# EAGLE design time_circuits_display (EAGLE 9.5.1)
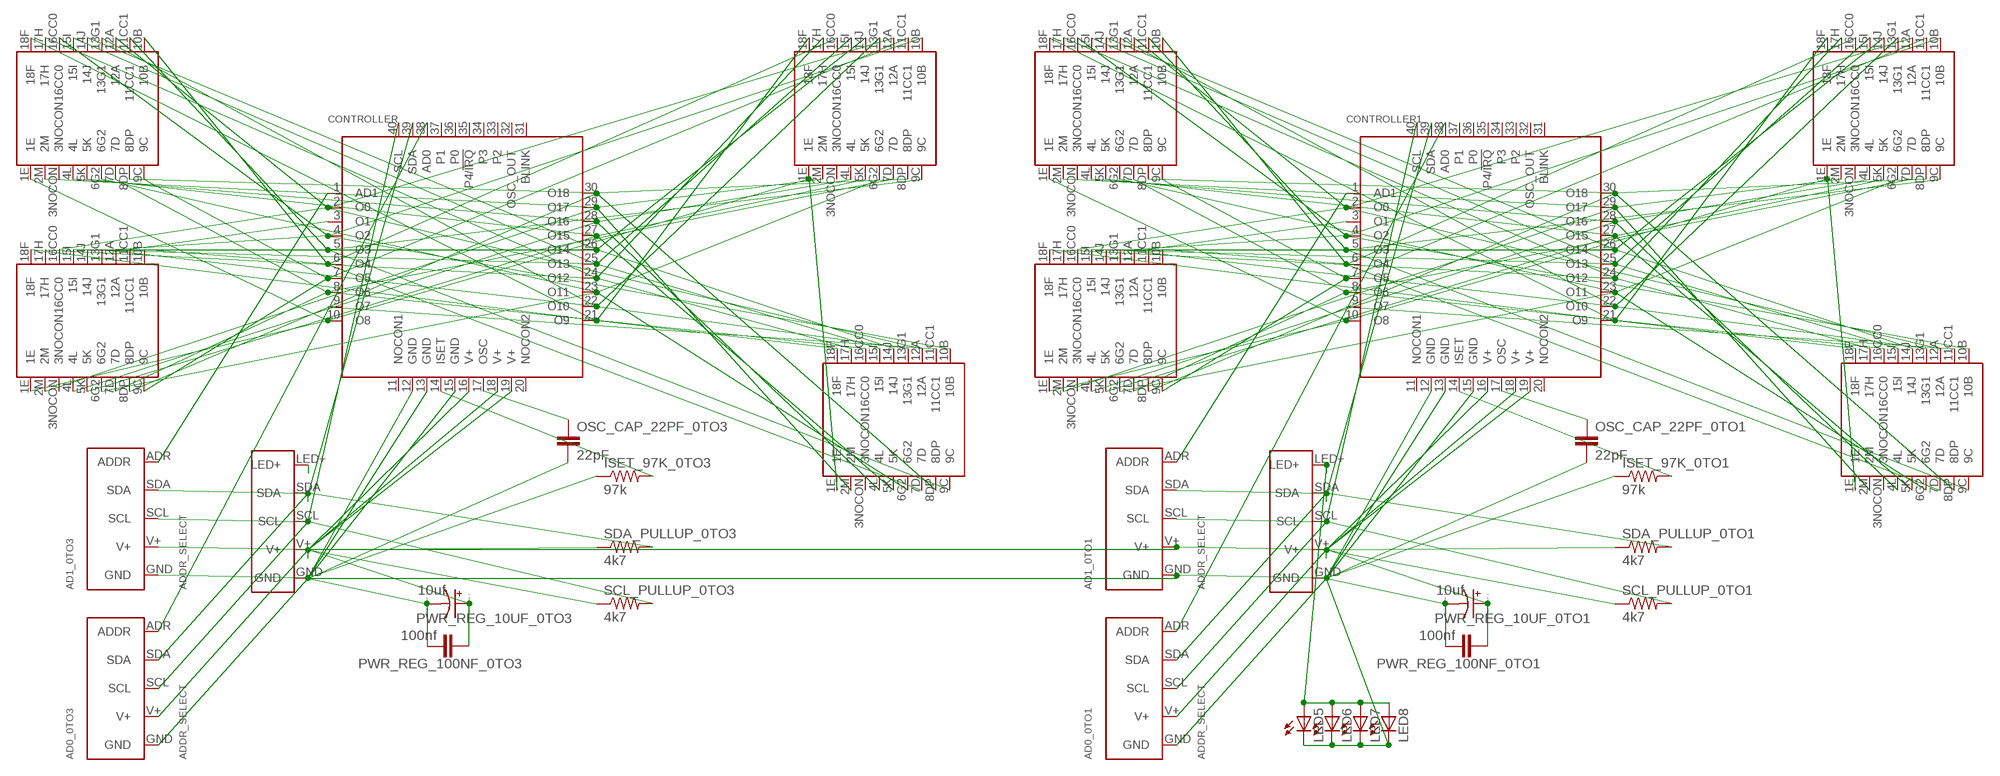
[diagram p0: schematic, sheet 1]

## Parts
AD0_0TO1  ADDR_SELECT  [ADDR_SELECT]
AD0_0TO3  ADDR_SELECT  [ADDR_SELECT]
AD1_0TO1  ADDR_SELECT  [ADDR_SELECT]
AD1_0TO3  ADDR_SELECT  [ADDR_SELECT]
CONTROLLER  MAX6955_TQFN40  [TQFN-EP-40]
CONTROLLER1  MAX6955_TQFN40  [TQFN-EP-40]
DISP0  LTP-3784  [LTP-3784]
DISP1  LTP-3784  [LTP-3784]
DISP2  LTP-3784  [LTP-3784]
DISP3  LTP-3784  [LTP-3784]
DISP4  LTP-3784  [LTP-3784]
DISP5  LTP-3784  [LTP-3784]
DISP6  LTP-3784  [LTP-3784]
DISP7  LTP-3784  [LTP-3784]
GVCD_0TO1  INTERCONNECTOR4  [INTERCONNECTOR4]
GVCD_0TO3  INTERCONNECTOR4  [INTERCONNECTOR4]
ISET_97K_0TO1  97k  R-US_0204/7  [0204/7]
ISET_97K_0TO3  97k  R-US_0204/7  [0204/7]
LED5  TLLR4400  [LED3MM]
LED6  TLLR4400  [LED3MM]
LED7  TLLR4400  [LED3MM]
LED8  TLLR4400  [LED3MM]
OSC_CAP_22PF_0TO1  22pF  C-EU025-024X044  [C025-024X044]
OSC_CAP_22PF_0TO3  22pF  C-EU025-024X044  [C025-024X044]
PWR_REG_10UF_0TO1  10uf  CPOL-USE2-5  [E2-5]
PWR_REG_10UF_0TO3  10uf  CPOL-USE2-5  [E2-5]
PWR_REG_100NF_0TO1  100nf  C-EU025-024X044  [C025-024X044]
PWR_REG_100NF_0TO3  100nf  C-EU025-024X044  [C025-024X044]
SCL_PULLUP_0TO1  4k7  R-US_0204/7  [0204/7]
SCL_PULLUP_0TO3  4k7  R-US_0204/7  [0204/7]
SDA_PULLUP_0TO1  4k7  R-US_0204/7  [0204/7]
SDA_PULLUP_0TO3  4k7  R-US_0204/7  [0204/7]

## Nets
GND: AD0_0TO1.GND AD0_0TO3.GND AD1_0TO1.GND AD1_0TO3.GND CONTROLLER1.12(GND) CONTROLLER1.13(GND) CONTROLLER1.15(GND) CONTROLLER.12(GND) CONTROLLER.13(GND) CONTROLLER.15(GND) GVCD_0TO1.GND GVCD_0TO3.GND ISET_97K_0TO1.1 ISET_97K_0TO3.1 LED5.K(C) LED6.K(C) LED7.K(C) LED8.K(C) OSC_CAP_22PF_0TO1.2 OSC_CAP_22PF_0TO3.2 PWR_REG_10UF_0TO1.- PWR_REG_10UF_0TO3.- PWR_REG_100NF_0TO1.2 PWR_REG_100NF_0TO3.2
N$1: CONTROLLER.21(O9) DISP0.18F DISP1.18F DISP2.18F DISP3.18F
N$2: AD1_0TO3.ADR(ADDR) CONTROLLER.1(AD1)
N$3: CONTROLLER.10(O8) DISP0.1E DISP1.1E DISP2.1E DISP3.1E
N$4: AD1_0TO1.ADR(ADDR) CONTROLLER1.1(AD1)
N$5: CONTROLLER.25(O13) DISP0.15I DISP1.15I DISP2.15I DISP3.15I
N$6: AD0_0TO3.ADR(ADDR) CONTROLLER.38(AD0)
N$7: CONTROLLER.2(O0) DISP0.16CC0 DISP1.12A DISP2.12A DISP3.12A
N$8: CONTROLLER.3(O1) DISP0.11CC1
N$9: CONTROLLER.4(O2) DISP0.12A DISP1.16CC0 DISP2.10B DISP3.10B
N$10: CONTROLLER.5(O3) DISP1.11CC1 DISP2.9C DISP3.9C
N$11: CONTROLLER.6(O4) DISP0.10B DISP1.10B DISP2.16CC0 DISP3.7D
N$12: CONTROLLER.7(O5) DISP0.9C DISP1.9C DISP2.11CC1
N$13: CONTROLLER.22(O10) DISP0.13G1 DISP1.13G1 DISP2.13G1 DISP3.13G1
N$14: CONTROLLER.9(O7) DISP3.11CC1
N$16: CONTROLLER.23(O11) DISP0.6G2 DISP1.6G2 DISP2.6G2 DISP3.6G2
N$17: CONTROLLER.24(O12) DISP0.17H DISP1.17H DISP2.17H DISP3.17H
N$18: CONTROLLER.26(O14) DISP0.14J DISP1.14J DISP2.14J DISP3.14J
N$19: CONTROLLER.27(O15) DISP0.5K DISP1.5K DISP2.5K DISP3.5K
N$20: CONTROLLER.28(O16) DISP0.4L DISP1.4L DISP2.4L DISP3.4L
N$21: CONTROLLER.29(O17) DISP0.2M DISP1.2M DISP2.2M DISP3.2M
N$22: CONTROLLER.30(O18) DISP0.8DP DISP1.8DP DISP2.8DP DISP3.8DP
N$23: CONTROLLER.17(OSC) OSC_CAP_22PF_0TO3.1
N$24: CONTROLLER.14(ISET) ISET_97K_0TO3.2
N$25: AD0_0TO3.SCL AD1_0TO3.SCL CONTROLLER.40(SCL) GVCD_0TO3.SCL SCL_PULLUP_0TO3.2
N$26: AD0_0TO1.ADR(ADDR) CONTROLLER1.38(AD0)
N$27: CONTROLLER.8(O6) DISP0.7D DISP1.7D DISP2.7D DISP3.16CC0
N$28: AD0_0TO3.SDA AD1_0TO3.SDA CONTROLLER.39(SDA) GVCD_0TO3.SDA SDA_PULLUP_0TO3.2
N$30: CONTROLLER1.2(O0) DISP4.16CC0 DISP5.12A DISP6.12A DISP7.12A
N$31: CONTROLLER1.3(O1) DISP4.11CC1
N$32: CONTROLLER1.4(O2) DISP4.12A DISP5.16CC0 DISP6.10B DISP7.10B
N$33: CONTROLLER1.5(O3) DISP5.11CC1 DISP6.9C DISP7.9C
N$34: CONTROLLER1.6(O4) DISP4.10B DISP5.10B DISP6.16CC0 DISP7.7D
N$35: CONTROLLER1.7(O5) DISP4.9C DISP5.9C DISP6.11CC1
N$36: CONTROLLER1.22(O10) DISP4.13G1 DISP5.13G1 DISP6.13G1 DISP7.13G1
N$37: CONTROLLER1.9(O7) DISP7.11CC1
N$38: CONTROLLER1.23(O11) DISP4.6G2 DISP5.6G2 DISP6.6G2 DISP7.6G2
N$39: CONTROLLER1.24(O12) DISP4.17H DISP5.17H DISP6.17H DISP7.17H
N$40: CONTROLLER1.26(O14) DISP4.14J DISP5.14J DISP6.14J DISP7.14J
N$41: CONTROLLER1.27(O15) DISP4.5K DISP5.5K DISP6.5K DISP7.5K
N$42: CONTROLLER1.28(O16) DISP4.4L DISP5.4L DISP6.4L DISP7.4L
N$43: CONTROLLER1.29(O17) DISP4.2M DISP5.2M DISP6.2M DISP7.2M
N$44: CONTROLLER1.30(O18) DISP4.8DP DISP5.8DP DISP6.8DP DISP7.8DP
N$45: CONTROLLER1.17(OSC) OSC_CAP_22PF_0TO1.1
N$46: CONTROLLER1.14(ISET) ISET_97K_0TO1.2
N$47: CONTROLLER1.8(O6) DISP4.7D DISP5.7D DISP6.7D DISP7.16CC0
N$48: AD0_0TO1.SDA AD1_0TO1.SDA CONTROLLER1.39(SDA) GVCD_0TO1.SDA SDA_PULLUP_0TO1.2
N$50: AD0_0TO1.SCL AD1_0TO1.SCL CONTROLLER1.40(SCL) GVCD_0TO1.SCL SCL_PULLUP_0TO1.2
N$51: GVCD_0TO1.LED+ LED5.A LED6.A LED7.A LED8.A
N$53: CONTROLLER1.21(O9) DISP4.18F DISP5.18F DISP6.18F DISP7.18F
N$54: CONTROLLER1.10(O8) DISP4.1E DISP5.1E DISP6.1E DISP7.1E
N$55: CONTROLLER1.25(O13) DISP4.15I DISP5.15I DISP6.15I DISP7.15I
N$57: GVCD_0TO3.LED+
VCC: AD0_0TO1.V+ AD0_0TO3.V+ AD1_0TO1.V+ AD1_0TO3.V+ CONTROLLER1.16(V+) CONTROLLER1.18(V+) CONTROLLER1.19(V+) CONTROLLER.16(V+) CONTROLLER.18(V+) CONTROLLER.19(V+) GVCD_0TO1.V+ GVCD_0TO3.V+ PWR_REG_10UF_0TO1.+ PWR_REG_10UF_0TO3.+ PWR_REG_100NF_0TO1.1 PWR_REG_100NF_0TO3.1 SCL_PULLUP_0TO1.1 SCL_PULLUP_0TO3.1 SDA_PULLUP_0TO1.1 SDA_PULLUP_0TO3.1
Unconnected: CONTROLLER1.11(NOCON1) CONTROLLER1.20(NOCON2) CONTROLLER1.31(BLINK) CONTROLLER1.32(OSC_OUT) CONTROLLER1.33(P2) CONTROLLER1.34(P3) CONTROLLER1.35(P4/!IRQ) CONTROLLER1.36(P0) CONTROLLER1.37(P1) CONTROLLER.11(NOCON1) CONTROLLER.20(NOCON2) CONTROLLER.31(BLINK) CONTROLLER.32(OSC_OUT) CONTROLLER.33(P2) CONTROLLER.34(P3) CONTROLLER.35(P4/!IRQ) CONTROLLER.36(P0) CONTROLLER.37(P1) DISP0.3NOCON DISP1.3NOCON DISP2.3NOCON DISP3.3NOCON DISP4.3NOCON DISP5.3NOCON DISP6.3NOCON DISP7.3NOCON

## Library data of the parts
AD0_0TO1 AD0_0TO3 AD1_0TO1 AD1_0TO3 = 00RonBarry:ADDR_SELECT
CONTROLLER CONTROLLER1 = MAX6955_TQFN40:MAX6955_TQFN40
DISP0 DISP1-DISP7 = 00RonBarry:LTP-3784
GVCD_0TO1 GVCD_0TO3 = 00RonBarry:INTERCONNECTOR4
ISET_97K_0TO1 ISET_97K_0TO3 SCL_PULLUP_0TO1 SCL_PULLUP_0TO3 SDA_PULLUP_0TO1 SDA_PULLUP_0TO3 = resistor:R-US_: RESISTOR, American symbol
LED5-LED8 = led:TLLR4400: Low Current (2mA) LED 3 mm Tinted Diffused Package color RED Source: Data sheet <http://www.farnell.com/datasheets/391100.pdf>; MF: VISHAY SEMICONDUCTOR; OC_FARNELL: 1612437
OSC_CAP_22PF_0TO1 OSC_CAP_22PF_0TO3 = resistor:C-EU: CAPACITOR, European symbol
PWR_REG_10UF_0TO1 PWR_REG_10UF_0TO3 = resistor:CPOL-US: POLARIZED CAPACITOR, American symbol
PWR_REG_100NF_0TO1 PWR_REG_100NF_0TO3 = rcl:C-EU: CAPACITOR, European symbol; SPICEPREFIX: C

## Net classes
0 default: width 0.254 mm, clearance 0.229 mm

## Board
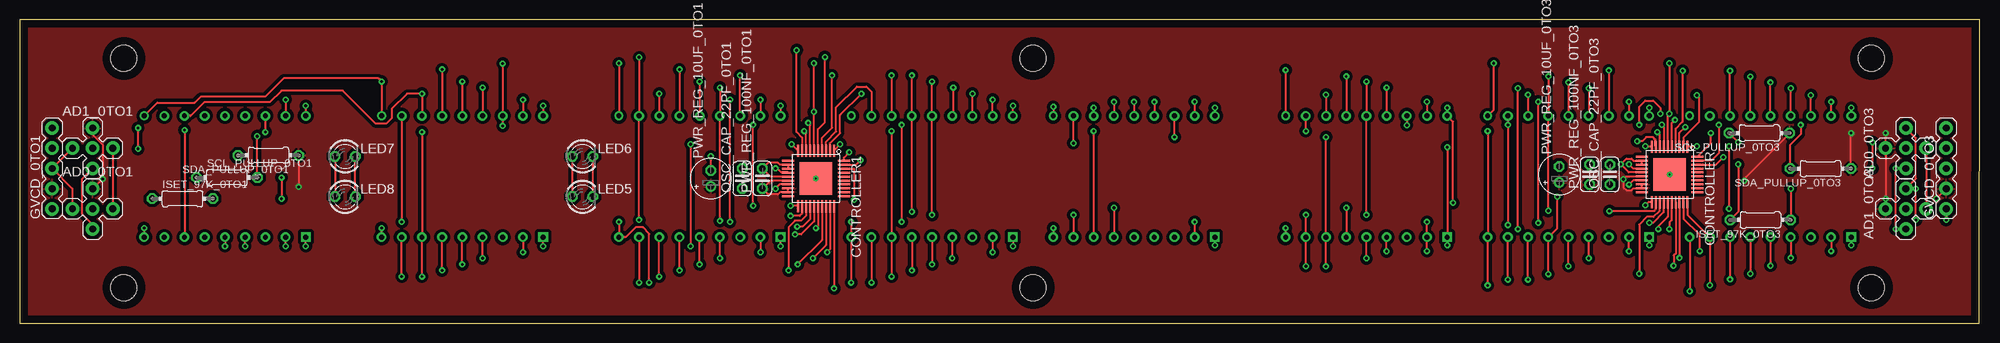
[diagram p1: board, top side]
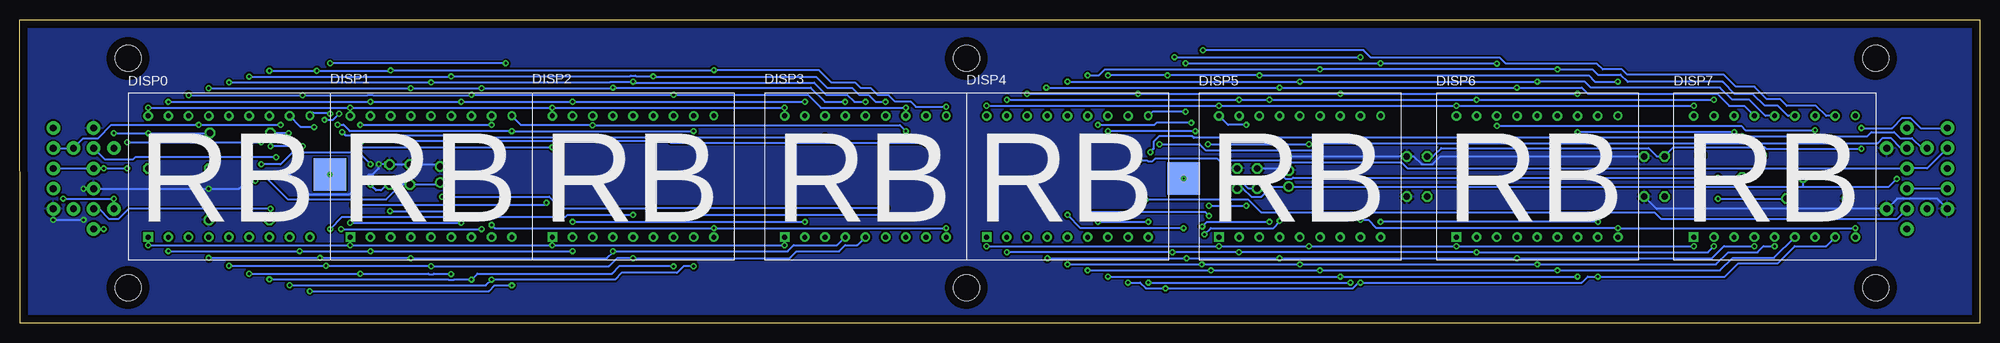
[diagram p2: board, bottom side, seen from below]

Size 246.39 x 38.1 mm. Coordinates in mm from the lower left corner, seen from the top.
Outline: 0,0 246.36,0 246.38,38.1 0,38.1 0,0
Copper layers (1+16): Top 0.035mm / dielectric 1.5mm / Bottom 0.035mm
Design rules "default *": minimum track width 6mil, minimum drill 0.35mm, track to track 9mil, track to pad 9mil, pad to pad 9mil, via to via 9mil, smd to smd 9mil, copper to edge 40mil, drill to drill 6mil, minimum pad ring 10mil, minimum via ring 8mil, stop-mask expansion 4mil, vias tented up to drill 0mil, thermal gap 10mil
Holes 3.3 mm at 127.38,33.27 232.79,33.27 13.08,33.27 13.08,4.45 127.38,4.45 232.79,4.45

### Footprints (pad centres in the part's own frame; a part is rotated, then mirrored left to right if it is on the bottom)
ADDR_SELECT = drill 0.85 pad 1.702: ADR 0,0; GND 2.54,0; SCL -2.54,0; SDA 0,-2.54; V+ 0,2.54
TQFN-EP-40 = smd 1.5 x 0.25: 1 -3.5,2.27; 2 -3.5,1.77; 3 -3.5,1.27; 4 -3.5,0.77; 5 -3.5,0.27; 6 -3.5,-0.23; 7 -3.5,-0.73; 8 -3.5,-1.23; 9 -3.5,-1.73; 10 -3.5,-2.23; 21 3.5,-2.23; 22 3.5,-1.73; 23 3.5,-1.23; 24 3.5,-0.73; 25 3.5,-0.23; 26 3.5,0.27; 27 3.5,0.77; 28 3.5,1.27; 29 3.5,1.77; 30 3.5,2.27 | smd 0.25 x 1.5: 11 -2.25,-3.48; 12 -1.75,-3.48; 13 -1.25,-3.48; 14 -0.75,-3.48; 15 -0.25,-3.48; 16 0.25,-3.48; 17 0.75,-3.48; 18 1.25,-3.48; 19 1.75,-3.48; 20 2.25,-3.48; 31 2.25,3.52; 32 1.75,3.52; 33 1.25,3.52; 34 0.75,3.52; 35 0.25,3.52; 36 -0.25,3.52; 37 -0.75,3.52; 38 -1.25,3.52; 39 -1.75,3.52; 40 -2.25,3.52 | smd 4.1 x 4.1: P$41 0,0 | drill 0.2: P$43 0,0 | smd 4.1 x 4.1 bottom: P$44 0,0
LTP-3784 = drill 0.602 pad 1.206 square: 1E -10.16,-7.62 | drill 0.602 pad 1.206: 2M -7.62,-7.62; 3NOCON -5.08,-7.62; 4L -2.54,-7.62; 5K 0,-7.62; 6G2 2.54,-7.62; 7D 5.08,-7.62; 8DP 7.62,-7.62; 9C 10.16,-7.62; 11CC1 7.62,7.62; 12A 5.08,7.62; 13G1 2.54,7.62; 14J 0,7.62; 15I -2.54,7.62; 16CC0 -5.08,7.62; 17H -7.62,7.62; 18F -10.16,7.62 | drill 0.602: 10B 10.16,7.62
INTERCONNECTOR4 = drill 0.85 pad 1.702: GND -3.81,0; LED+ 6.35,0; SCL 1.27,0; SDA 3.81,0; V+ -1.27,0
0204/7 = drill 0.813 octagon: 1 -3.81,0; 2 3.81,0
LED3MM = drill 0.813 octagon: A -1.27,0; K 1.27,0
C025-024X044 = drill 0.813 octagon: 1 -1.27,0; 2 1.27,0
E2-5 = drill 0.813 pad 1.27: + -1.016,0 | drill 0.813 pad 1.27 octagon: - 1.016,0

### Placement (x,y rotation side)
AD0_0TO1  9.14,14.35 0 top
AD0_0TO3  237.11,21.97 90 top
AD1_0TO1  9.14,21.97 0 top
AD1_0TO3  237.11,14.35 90 top
CONTROLLER  207.39,18.67 270 top
CONTROLLER1  100.08,18.16 270 top
DISP0  220.09,18.41 0 bottom
DISP1  194.69,18.41 0 bottom
DISP2  169.29,18.41 0 bottom
DISP3  140.08,18.41 0 bottom
DISP4  114.68,18.41 0 bottom
DISP5  85.47,18.41 0 bottom
DISP6  55.63,18.41 0 bottom
DISP7  25.78,18.41 0 bottom
GVCD_0TO1  4.06,18.16 90 top
GVCD_0TO3  242.19,18.16 90 top
ISET_97K_0TO1  20.45,15.62 0 top
ISET_97K_0TO3  218.82,12.95 180 top
LED5  70.74,15.88 0 top
LED6  70.74,20.95 0 top
LED7  40.89,20.95 0 top
LED8  40.89,15.88 0 top
OSC_CAP_22PF_0TO1  90.81,18.16 90 top
OSC_CAP_22PF_0TO3  199.9,18.67 90 top
PWR_REG_10UF_0TO1  86.87,18.16 90 top
PWR_REG_10UF_0TO3  193.55,18.67 90 top
PWR_REG_100NF_0TO1  93.34,18.16 90 top
PWR_REG_100NF_0TO3  197.36,18.67 90 top
SCL_PULLUP_0TO1  26.04,18.29 0 top
SCL_PULLUP_0TO3  218.69,23.88 180 top
SDA_PULLUP_0TO1  31.24,21.08 180 top
SDA_PULLUP_0TO3  226.39,19.41 180 top

### Tracks (layer width: path | path; a pad name or v marks a point on that pad's centre or on a via)
GND  (via drill 0.35)
  Top 0.254: CONTROLLER.13 CONTROLLER.12 202.87,20.42 202.62,20.67 201.98,20.67 201.26,19.95 201.27,19.94 v201.25,19.94 202.27,18.92 CONTROLLER.15 | GVCD_0TO3.GND v242.19,12.95 | v238.38,12.95 v238.38,16.89 | AD1_0TO3.GND 238.38,18.16 238.38,23.24 AD0_0TO3.GND | v222.63,16.89 ISET_97K_0TO3.1 | 96.58,18.43 CONTROLLER1.15 94.36,18.41 PWR_REG_100NF_0TO1.2 94.08,20.16 95.3,20.16 95.55,19.91 CONTROLLER1.12 CONTROLLER1.13 | LED6.K LED5.K | LED8.K LED7.K | PWR_REG_10UF_0TO1.- v86.87,20.95 | AD1_0TO1.GND AD0_0TO1.GND
  Bottom 0.254: PWR_REG_10UF_0TO3.- 193.8,19.94 PWR_REG_100NF_0TO3.2 OSC_CAP_22PF_0TO3.2 v201.25,19.94 201.25,19.45 202.03,18.67 202.49,18.67 204.95,16.2 210.03,16.2 212.5,18.67 217.04,18.67 218.82,16.89 v222.63,16.89 AD1_0TO3.GND v238.38,16.89 | v242.19,12.95 v238.38,12.95 | OSC_CAP_22PF_0TO1.2 87.12,19.43 PWR_REG_10UF_0TO1.- | v86.87,20.95 LED6.K 71.16,20.95 70.14,19.94 68.79,19.94 67.78,20.95 LED7.K | 16.64,14.35 AD0_0TO1.GND 11.66,14.35 10.38,15.64 5.35,15.64 GVCD_0TO1.GND | 16.64,14.35 40.64,14.35 LED8.K | ISET_97K_0TO1.1 16.64,14.35
  pour Bottom (isolate 0.406): 0.13,0.13 0.13,37.97 246.25,37.97 246.25,0.13
  pour Bottom: -0.51,38.86 -0.51,-0.51 -0.89,-0.89 246.89,-0.89 247.01,-0.76 247.01,38.35 246.63,38.73 -0.38,38.73
N$1  (via drill 0.35)
  Top 0.254: DISP0.18F v230.25,27.05 | v204.85,27.05 DISP1.18F | v179.45,27.05 DISP2.18F 180.19,25.3 v180.19,15.11 | v150.24,27.05 DISP3.18F | CONTROLLER.21 204.73,15.17 v204.37,14.81
  Bottom 0.254: v230.25,27.05 v204.85,27.05 v179.45,27.05 v150.24,27.05 | v204.37,14.81 204.34,14.83 180.46,14.83 v180.19,15.11
N$2  (via drill 0.35)
  Top 0.254: CONTROLLER.1 209.72,22.23 v210.82,22.23 | v214.88,22.23 v214.88,14.35
  Bottom 0.254: v210.82,22.23 v214.88,22.23 | v214.88,14.35 232.72,14.35 234.01,13.06 235.12,13.06 236.41,14.35 AD1_0TO3.ADR
N$3  (via drill 0.35)
  Top 0.254: DISP0.1E v230.25,9.78 | v204.85,9.78 DISP1.1E | v179.45,9.78 DISP2.1E v179.45,22.1 | v150.24,9.78 DISP3.1E | CONTROLLER.10 204.4,22.17 v204.34,22.23
  Bottom 0.254: v230.25,9.78 v204.85,9.78 v179.45,9.78 v150.24,9.78 | v204.34,22.23 204.22,22.1 v179.45,22.1
N$4  (via drill 0.35)
  Top 0.254: CONTROLLER1.1 103.12,22.44 v103.12,22.48
  Bottom 0.254: v103.12,22.48 98.07,22.48 97.33,21.75 83.9,21.75 83.02,22.62 12.83,22.62 12.19,23.26 11.2,23.26 9.91,21.97 AD1_0TO1.ADR
N$5  (via drill 0.35)
  Top 0.254: DISP0.15I v222.63,29.51 | v197.23,29.51 DISP1.15I | v171.83,29.59 DISP2.15I | v142.62,27.79 DISP3.15I | CONTROLLER.25 207.16,13.36 205.99,12.19 v205.99,11.81 | v188.34,11.81 v188.34,29.51
  Bottom 0.254: v222.63,29.51 v197.23,29.51 v188.34,29.51 171.92,29.51 v171.83,29.59 146.97,29.59 145.16,27.79 v142.62,27.79 | v205.99,11.81 v188.34,11.81
N$6  (via drill 0.35)
  Top 0.254: CONTROLLER.38 213.24,19.92 v214.15,20.83
  Bottom 0.254: v214.15,20.83 231.9,20.83 232.16,20.57 235.71,20.57 AD0_0TO3.ADR
N$7  (via drill 0.35)
  Top 0.254: DISP0.16CC0 v225.17,28.65 | v189.61,28.7 DISP1.12A | v164.21,28.7 DISP2.12A | v135,27.05 DISP3.12A | v210.82,28.65 211.07,28.39 211.07,25.21 209.16,23.3 CONTROLLER.2
  Bottom 0.254: v225.17,28.65 v210.82,28.65 202.64,28.65 202.62,28.67 202.01,28.67 201.98,28.65 189.67,28.65 v189.61,28.7 v164.21,28.7 147.32,28.7 145.67,27.05 v135,27.05
N$8  (via drill 0.35)
  Top 0.254: CONTROLLER.3 208.66,23.89 v209.4,24.64
  Bottom 0.254: v209.4,24.64 209.46,24.69 211.13,24.69 DISP0.11CC1
N$9  (via drill 0.35)
  Top 0.254: DISP0.12A v215.01,31.71 | v199.77,31.75 DISP1.16CC0 | v159.13,31.8 DISP2.10B | v129.92,27.18 DISP3.10B | CONTROLLER.4 208.16,24.43 209.01,25.28 209.01,31.68 v209.04,31.71
  Bottom 0.254: v215.01,31.71 v209.04,31.71 199.81,31.71 v199.77,31.75 159.18,31.75 v159.13,31.8 145.92,31.8 144.35,30.23 141.35,30.23 140.65,29.53 139.38,29.53 138.49,28.64 137.16,28.64 136.33,27.81 134.37,27.81 133.73,27.18 v129.92,27.18
N$10  (via drill 0.35)
  Top 0.254: CONTROLLER.5 207.66,25.1 v208.09,25.53 | DISP1.11CC1 v187.07,24.89 v187.07,12.32 | v159.13,11.94 DISP2.9C | v129.92,11.94 DISP3.9C | v203.58,24.89 203.58,27.18 204.34,27.94 205.36,27.94 206.25,27.05 v206.25,26.29
  Bottom 0.254: v203.58,24.89 v187.07,24.89 | v187.07,12.32 186.69,11.94 v159.13,11.94 v129.92,11.94 | v208.09,25.53 207.01,25.53 v206.25,26.29
N$11  (via drill 0.35)
  Top 0.254: CONTROLLER.6 207.16,26.09 v207.39,26.32 v207.39,32.64 | DISP2.16CC0 v174.37,24.86 | v135,24.13 DISP3.7D | DISP1.10B 185.29,26.8 v185.29,32.64
  Bottom 0.254: v207.39,26.32 207.52,26.44 209.52,26.44 DISP0.10B | v135,24.13 135.74,24.86 v174.37,24.86 183.36,24.86 DISP1.10B | v185.29,32.64 v207.39,32.64
N$12  (via drill 0.35)
  Top 0.254: DISP0.9C v209.93,4.01 | v184.53,4.73 DISP1.9C v184.53,24.13 | CONTROLLER.7 206.67,24.69 v206.44,24.92 v206.43,24.92 | v161.67,24.13 DISP2.11CC1
  Bottom 0.254: v209.93,4.01 187.41,4.01 186.69,4.73 v184.53,4.73 | v206.43,24.92 205.69,24.92 204.93,24.16 184.56,24.16 v184.53,24.13 v161.67,24.13
N$13  (via drill 0.35)
  Top 0.254: DISP0.13G1 v217.55,30.97 | v192.15,30.99 DISP1.13G1 v192.15,14.1 | v166.75,30.99 DISP2.13G1 | v137.54,27.79 DISP3.13G1 | CONTROLLER.22 205.64,15.15 205.64,14.27 205.43,14.06 199.86,14.06 v199.85,14.08
  Bottom 0.254: v217.55,30.97 192.16,30.97 v192.15,30.99 169.69,30.99 169.59,31.09 168.99,31.09 168.89,30.99 v166.75,30.99 166.62,30.99 166.57,30.94 146.26,30.94 144.85,29.52 141.73,29.52 140.84,28.64 139.64,28.64 138.79,27.79 v137.54,27.79 | v199.85,14.08 192.17,14.08 v192.15,14.1
N$14  (via drill 0.35)
  Top 0.254: CONTROLLER.9 205.64,22.19 205.64,23.06 205.34,23.37 204.47,23.37 203.96,22.86 v203.33,22.86 | v132.46,22.61 DISP3.11CC1
  Bottom 0.254: v132.46,22.61 132.49,22.63 164.51,22.63 164.77,22.89 203.3,22.89 v203.33,22.86
N$16  (via drill 0.35)
  Top 0.254: DISP0.6G2 v217.55,6.21 | v192.15,6.15 DISP1.6G2 193.29,11.94 v193.29,15.88 | CONTROLLER.23 206.14,15.15 206.14,14.22 | 206.14,14.22 206.14,14.09 | 206.14,14.22 206.13,14.21 206.13,14.07 205.39,13.34 204.55,13.34 203.58,12.37 v203.58,6.21 | v166.75,14.48 DISP2.6G2 | v137.54,14.48 DISP3.6G2
  Bottom 0.254: v192.15,6.15 192.21,6.21 194.33,6.21 194.39,6.15 195,6.15 195.05,6.21 v203.58,6.21 v217.55,6.21 | v193.29,15.88 179.83,15.88 178.41,14.45 166.78,14.45 v166.75,14.48 v137.54,14.48
N$17  (via drill 0.35)
  Top 0.254: DISP0.17H v227.71,27.79 | v202.31,27.81 DISP1.17H | v176.91,27.81 DISP2.17H | v147.7,27.81 DISP3.17H | CONTROLLER.24 206.64,15.15 206.64,13.91 205.33,12.6 v204.85,12.6 | v190.88,12.57 v190.88,27.81
  Bottom 0.254: v227.71,27.79 202.34,27.79 v202.31,27.81 v190.88,27.81 v176.91,27.81 v147.7,27.81 | v204.85,12.6 190.91,12.6 v190.88,12.57
N$18  (via drill 0.35)
  Top 0.254: DISP0.14J v220.09,30.24 | v194.69,30.24 DISP1.14J | v169.29,30.35 DISP2.14J v169.29,13.59 | v140.08,27.79 DISP3.14J | CONTROLLER.26 207.64,15.15 207.64,12.9 207.39,12.65 v207.39,11.81
  Bottom 0.254: v220.09,30.24 v194.69,30.24 172.22,30.24 172.13,30.32 169.32,30.32 v169.29,30.35 169.14,30.2 146.54,30.2 145.04,28.7 142.37,28.7 141.46,27.79 v140.08,27.79 | v207.39,11.81 205.87,13.34 177.8,13.34 177.55,13.59 v169.29,13.59
N$19  (via drill 0.35)
  Top 0.254: DISP0.5K v220.09,7.2 | v194.69,7.14 DISP1.5K | v169.29,8.13 DISP2.5K | v207.9,7.2 207.93,7.22 207.93,8.49 208.16,8.72 CONTROLLER.27
  Bottom 0.254: v220.09,7.2 v207.9,7.2 194.75,7.2 v194.69,7.14 172.31,7.14 171.32,8.13 v169.29,8.13 149.61,8.13 148.72,9.02 143.38,9.02 142.62,9.78 141.1,9.78 DISP3.5K
N$20  (via drill 0.35)
  Top 0.254: DISP0.4L v222.63,8.18 | v197.23,8.13 DISP1.4L | v171.83,9.02 DISP2.4L | CONTROLLER.28 v208.66,8.18
  Bottom 0.254: v222.63,8.18 v208.66,8.18 197.29,8.18 v197.23,8.13 172.59,8.13 171.83,8.89 v171.83,9.02 149.86,9.02 149.1,9.78 143.64,9.78 DISP3.4L
N$21  (via drill 0.35)
  Top 0.254: DISP0.2M v227.71,9.04 | v202.31,9.02 DISP1.2M | v176.91,9.04 DISP2.2M v176.91,12.7 | CONTROLLER.29 209.16,13.13 211.15,11.14 211.15,9.1 v211.2,9.04 | v147.7,12.7 DISP3.2M
  Bottom 0.254: v227.71,9.04 v211.2,9.04 202.34,9.04 v202.31,9.02 176.94,9.02 v176.91,9.04 | v176.91,12.7 v147.7,12.7
N$22  (via drill 0.35)
  Top 0.254: v212.47,4.74 DISP0.8DP 209.66,13.61 CONTROLLER.30 | v187.07,5.46 DISP1.8DP | v161.67,7.14 DISP2.8DP v161.67,13.59 | v132.46,13.59 DISP3.8DP
  Bottom 0.254: v212.47,4.74 189.93,4.74 189.91,4.73 187.81,4.73 v187.07,5.46 171.58,5.46 170.74,6.3 163.78,6.3 162.94,7.14 v161.67,7.14 | v161.67,13.59 v132.46,13.59
N$23  (via drill 0.35)
  Top 0.254: CONTROLLER.17 202.83,17.92 v202.31,17.4
  Bottom 0.254: OSC_CAP_22PF_0TO3.1 200.26,17.4 200.99,16.66 201.6,16.66 202.03,17.09 202.03,17.12 v202.31,17.4
N$24  (via drill 0.35)
  Top 0.254: CONTROLLER.14 202.83,19.42 v202.31,19.94 | v216.03,19.94 216.03,13.97 ISET_97K_0TO3.2
  Bottom 0.254: v202.31,19.94 203.81,21.44 212.12,21.44 213.61,19.94 v216.03,19.94
N$25  (via drill 0.35)
  Top 0.254: v235.84,11.81 v235.84,19.43 | v232.92,22.73 v232.92,19.43 | v216.03,22.73 SCL_PULLUP_0TO3.2 | CONTROLLER.40 212.6,22.61 v212.6,23.88
  Bottom 0.254: AD1_0TO3.SCL v235.84,11.81 | GVCD_0TO3.SCL AD0_0TO3.SCL v235.84,19.43 v232.92,19.43 | v232.92,22.73 v216.03,22.73 | v212.6,23.88 SCL_PULLUP_0TO3.2
N$26  (via drill 0.35)
  Top 0.254: CONTROLLER1.38 104.87,19.41 104.9,19.38 v104.9,15.49
  Bottom 0.254: AD0_0TO1.ADR 10.43,13.06 40.03,13.06 40.84,13.87 90.3,13.87 91.9,15.47 104.87,15.47 v104.9,15.49
N$27  (via drill 0.35)
  Top 0.254: DISP0.7D v215.01,5.47 | v189.61,5.46 DISP1.7D | v164.21,7.11 DISP2.7D v164.21,23.37 | CONTROLLER.8 206.16,23.71 v205.87,24 | v145.16,23.37 DISP3.16CC0
  Bottom 0.254: v215.01,5.47 192.51,5.47 192.46,5.42 191.85,5.42 191.79,5.47 189.62,5.47 v189.61,5.46 188.85,6.22 171.96,6.22 171.07,7.11 v164.21,7.11 | v205.87,24 205.46,23.59 187.81,23.59 187.58,23.37 v164.21,23.37 v145.16,23.37
N$28  (via drill 0.35)
  Top 0.254: AD0_0TO3.SDA AD1_0TO3.SDA | CONTROLLER.39 212.67,20.41 213.61,21.36 v213.61,24.89 | SDA_PULLUP_0TO3.2 222.58,22.39 223.9,23.71 223.9,24.87 v223.88,24.89
  Bottom 0.254: 242.32,21.84 GVCD_0TO3.SDA AD0_0TO3.SDA 238.4,23.22 236.55,23.22 234.88,24.89 v223.88,24.89 v213.61,24.89
N$30  (via drill 0.35)
  Top 0.254: DISP4.16CC0 v119.76,28.83 | v80.39,28.83 DISP5.12A | DISP6.12A v50.55,28.83 48.68,28.83 46.76,26.91 46.76,25.76 46.07,25.07 44.74,25.07 40.6,29.21 32.89,29.21 31.43,27.75 23.18,27.75 21.46,26.04 DISP7.12A | CONTROLLER1.2 101.85,22.6 103.12,23.88 103.12,26.16 v105.79,28.83
  Bottom 0.254: v119.76,28.83 v105.79,28.83 v80.39,28.83 v50.55,28.83
N$31
  Top 0.254: CONTROLLER1.3 101.36,21.68 101.36,22.8 102.64,24.08 102.64,27.12 105.24,29.72 106.43,29.72 107.06,29.08 DISP4.11CC1
N$32  (via drill 0.35)
  Top 0.254: DISP5.16CC0 v90.55,31.11 | DISP6.10B v45.47,30.35 45.09,30.73 33.15,30.73 30.86,28.45 22.73,28.45 21.97,27.69 17.27,27.69 DISP7.10B | v109.6,31.11 DISP4.12A | CONTROLLER1.4 100.85,23.29 102.11,24.55 v102.11,31.11
  Bottom 0.254: v45.47,30.35 48.39,30.35 49.15,31.11 v90.55,31.11 v102.11,31.11 v109.6,31.11
N$33  (via drill 0.35)
  Top 0.254: DISP6.9C v45.47,11.94 | v15.62,11.94 DISP7.9C | CONTROLLER1.5 100.35,24.38 101.22,25.25 v101.22,33.43 | v77.85,33.4 DISP5.11CC1 v77.85,12.95
  Bottom 0.254: v15.62,11.94 v45.47,11.94 75.82,11.94 76.83,12.95 v77.85,12.95 | v101.22,33.43 77.88,33.43 v77.85,33.4
N$34  (via drill 0.35)
  Top 0.254: CONTROLLER1.6 99.85,26.52 v99.82,26.54 v99.82,32.64 | v75.31,32.64 DISP5.10B | v60.71,32.61 DISP6.16CC0 v60.71,24.77 | v20.7,24.26 DISP7.7D
  Bottom 0.254: v99.82,26.54 104.01,26.54 DISP4.10B | v99.82,32.64 v75.31,32.64 60.73,32.64 v60.71,32.61 | v60.71,24.77 29.97,24.77 29.46,24.26 v20.7,24.26
N$35  (via drill 0.35)
  Top 0.254: v104.52,5.08 DISP4.9C v104.52,12.7 | v79.12,5.08 79.12,11.21 78.32,12.01 77.38,12.01 76.16,10.79 DISP5.9C v75.31,12.7 | CONTROLLER1.7 99.35,24.91 v99.11,25.15 | DISP6.11CC1 v48.01,12.7 | v110.87,24.89 v110.87,12.7
  Bottom 0.254: v104.52,5.08 v79.12,5.08 | v48.01,12.7 v75.31,12.7 | v99.11,25.15 103.5,25.15 103.76,24.89 v110.87,24.89 | v110.87,12.7 v104.52,12.7
N$36  (via drill 0.35)
  Top 0.254: CONTROLLER1.22 98.35,13.76 98.04,13.46 v96.9,13.46 | v53.09,31.88 DISP6.13G1 | v82.93,31.88 DISP5.13G1 | v112.14,31.11 DISP4.13G1 v112.14,13.97
  Bottom 0.254: DISP7.13G1 24.09,26.04 25.38,27.32 27.03,27.32 28.49,28.78 30.78,28.78 32.3,30.31 44.24,30.31 45.15,31.22 48.01,31.22 48.64,31.85 53.06,31.85 v53.09,31.88 v82.93,31.88 109.98,31.88 110.74,31.11 v112.14,31.11 | v112.14,13.97 97.41,13.97 v96.9,13.46
N$37  (via drill 0.35)
  Top 0.254: CONTROLLER1.9 98.35,23.3 97.63,24.02 97.63,34.25 v97.66,34.29
  Bottom 0.254: v97.66,34.29 77.47,34.29 76.55,33.37 60.33,33.37 59.56,32.61 48.13,32.61 47.4,31.88 44.96,31.88 44.32,31.24 32.19,31.24 30.67,29.72 28.32,29.72 26.73,28.13 25.08,28.13 24.26,27.3 20.57,27.3 19.3,26.04 DISP7.11CC1
N$38  (via drill 0.35)
  Top 0.254: DISP4.6G2 v112.14,6.6 | v82.93,6.6 DISP5.6G2 | v53.09,6.6 DISP6.6G2 | CONTROLLER1.23 98.83,14.64 98.83,13.46 98.22,12.86 97.44,12.86 96.65,12.06 v96.65,6.6
  Bottom 0.254: v112.14,6.6 v96.65,6.6 v82.93,6.6 v53.09,6.6 32.64,6.6 31.05,8.19 25.84,8.19 DISP7.6G2
N$39  (via drill 0.35)
  Top 0.254: DISP4.17H v122.3,28.07 | v93.09,28.07 DISP5.17H | v63.25,28.07 DISP6.17H | v33.4,28.07 DISP7.17H | v97.74,12.12 98.42,12.12 99.35,13.04 CONTROLLER1.24 | v89.28,12.7 v89.28,28.07
  Bottom 0.254: v122.3,28.07 v93.09,28.07 v89.28,28.07 v63.25,28.07 v33.4,28.07 | v97.74,12.12 97.16,12.7 v89.28,12.7
N$40  (via drill 0.35)
  Top 0.254: v114.68,30.35 DISP4.14J v114.68,13.59 | v85.47,30.35 DISP5.14J | v55.63,30.35 DISP6.14J | CONTROLLER1.26 100.35,12.21 v100.08,11.94
  Bottom 0.254: v114.68,30.35 v85.47,30.35 v55.63,30.35 49.66,30.35 48.9,29.59 32.64,29.59 31.11,28.07 28.96,28.07 26.92,26.04 DISP7.14J | v100.08,11.94 113.03,11.94 v114.68,13.59
N$41  (via drill 0.35)
  Top 0.254: DISP4.5K v114.68,7.37 | v85.47,7.37 DISP5.5K | v55.63,7.37 DISP6.5K | DISP7.5K v25.78,9.65 | CONTROLLER1.27 100.85,10.42 v97.79,7.37
  Bottom 0.254: v114.68,7.37 v97.79,7.37 v85.47,7.37 v55.63,7.37 33.15,7.37 31.62,8.89 27.94,8.89 27.18,9.65 v25.78,9.65
N$42  (via drill 0.35)
  Top 0.254: DISP4.4L v117.22,8.13 | v88.01,8.13 DISP5.4L | v58.17,8.13 DISP6.4L | v28.32,9.65 DISP7.4L | CONTROLLER1.28 101.35,9.78 v99.69,8.13
  Bottom 0.254: v117.22,8.13 v99.69,8.13 v88.01,8.13 v58.17,8.13 33.66,8.13 32.13,9.65 v28.32,9.65
N$43  (via drill 0.35)
  Top 0.254: DISP4.2M v122.3,8.89 | DISP6.2M v63.25,8.89 | v33.4,9.65 DISP7.2M | CONTROLLER1.29 101.85,9.24 v101.5,8.89 | DISP5.2M 93.09,8.91 v93.12,8.89
  Bottom 0.254: v122.3,8.89 v101.5,8.89 v93.12,8.89 v63.25,8.89 34.16,8.89 v33.4,9.65
N$44  (via drill 0.35)
  Top 0.254: DISP5.8DP v77.85,5.08 | v48.01,5.84 DISP6.8DP | DISP4.8DP v107.06,5.08 | CONTROLLER1.30 102.35,4.36 v102.36,4.35
  Bottom 0.254: DISP7.8DP 19.3,9.65 23.24,9.65 25.4,7.49 30.35,7.49 32,5.84 v48.01,5.84 49.28,5.84 50.04,5.08 v77.85,5.08 78.08,5.08 78.82,4.35 v102.36,4.35 104.83,4.35 105.56,5.08 v107.06,5.08
N$45  (via drill 0.35)
  Top 0.254: CONTROLLER1.17 95.52,17.41 v95,16.89
  Bottom 0.254: OSC_CAP_22PF_0TO1.1 91.91,16.89 92.92,17.91 93.77,17.91 94.78,16.89 v95,16.89
N$46  (via drill 0.35)
  Top 0.254: CONTROLLER1.14 96.58,18.93 95.7,18.93 95.2,19.43 v95,19.43 | v32.89,18.29 v32.89,15.62
  Bottom 0.254: v95,19.43 93.95,18.39 87.52,18.39 87.29,18.16 86.45,18.16 86.32,18.29 v32.89,18.29 | v32.89,15.62 ISET_97K_0TO1.2
N$47  (via drill 0.35)
  Top 0.254: v109.6,5.84 DISP4.7D v109.6,24.13 | v80.39,5.84 DISP5.7D | v50.55,5.84 DISP6.7D v50.55,24 | CONTROLLER1.8 98.85,23.9 v98.61,24.13 | DISP7.16CC0 v30.86,24
  Bottom 0.254: v109.6,5.84 v80.39,5.84 v50.55,5.84 | v30.86,24 v50.55,24 | v98.61,24.13 v109.6,24.13
N$48  (via drill 0.35)
  Top 0.254: CONTROLLER1.39 105.13,19.91 v105.66,20.45 | AD0_0TO1.SDA 9.14,12.38 7.86,13.67 7.86,18.14 AD1_0TO1.SDA
  Bottom 0.254: GVCD_0TO1.SDA 6.6,19.43 AD1_0TO1.SDA 9.17,19.46 27.43,19.46 | v105.66,20.45 104.67,20.45 104.57,20.35 103.96,20.35 103.61,20.7 95.86,20.7 95.61,20.45 87.4,20.45 87.17,20.22 72.71,20.22 71.95,19.46 27.43,19.46 | SDA_PULLUP_0TO1.2 27.43,19.46
N$50  (via drill 0.35)
  Top 0.254: v104.27,21.46 103.6,20.79 CONTROLLER1.40 | AD1_0TO1.SCL GVCD_0TO1.SCL 6.6,16.89 AD0_0TO1.SCL | SCL_PULLUP_0TO1.2 v29.84,23.48
  Bottom 0.254: v104.27,21.46 103.86,21.87 103.86,22.78 103.16,23.48 99,23.48 98.79,23.27 30.56,23.27 30.34,23.48 v29.84,23.48 v29.84,23.49 14.1,23.49 13.59,24 10.74,24 9.99,23.24 8.51,23.24 7.24,21.97 AD1_0TO1.SCL
N$51  (via drill 0.35)
  Top 0.254: LED5.A LED6.A | LED7.A LED8.A | v14.86,21.89 v14.86,24.51
  Bottom 0.254: LED6.A 68.72,20.95 67.7,21.97 41.62,21.97 40.6,20.95 LED7.A 38.48,22.1 27.01,22.1 26.8,21.89 v14.86,21.89 | v14.86,24.51 10.99,24.51 9.7,25.8 8.71,25.8 7.43,24.51 GVCD_0TO1.LED+
N$53  (via drill 0.35)
  Top 0.254: CONTROLLER1.21 97.78,14.73 v96.9,14.73 | DISP4.18F v124.84,27.3 | v95.63,27.3 DISP5.18F | v65.79,27.3 DISP6.18F | v35.94,27.3 DISP7.18F | v92.2,14.73 v92.2,24.89
  Bottom 0.254: v124.84,27.3 v95.63,27.3 v65.79,27.3 v35.94,27.3 | v96.9,14.73 v92.2,14.73 | v92.2,24.89 94.49,24.89 DISP5.18F
N$54  (via drill 0.35)
  Top 0.254: DISP4.1E v124.84,9.65 | v95.63,9.65 DISP5.1E | v65.79,9.65 DISP6.1E | v35.94,9.65 DISP7.1E | CONTROLLER1.10 v97.03,22.48 | v84.33,22.48 v84.33,9.65
  Bottom 0.254: v124.84,9.65 v95.63,9.65 v84.33,9.65 v65.79,9.65 v35.94,9.65 | v97.03,22.48 v84.33,22.48
N$55  (via drill 0.35)
  Top 0.254: v58.17,29.59 DISP6.15I | DISP4.15I 117.35,26.16 v117.35,29.59 | v88.01,29.59 DISP5.15I v88.01,12.83 | CONTROLLER1.25 99.85,12.76 98.22,11.13 v97.45,11.13
  Bottom 0.254: v117.35,29.59 v88.01,29.59 v58.17,29.59 50.04,29.59 49.25,28.8 32.99,28.8 31.5,27.3 29.59,27.3 DISP7.15I | v97.45,11.13 96.65,11.94 88.77,11.94 88.01,12.7 v88.01,12.83
VCC  (via drill 0.35)
  Top 0.254: AD1_0TO1.V+ 9.14,23.69 10.43,22.4 v10.43,18.11 9.21,16.89 AD0_0TO1.V+ | SDA_PULLUP_0TO1.1 v35.05,17.1 | CONTROLLER.18 CONTROLLER.19 202.87,16.92 202.62,16.66 202.01,16.66 201.58,17.09 v201.58,18.06 201.92,18.4 203.89,18.4 CONTROLLER.16 | AD1_0TO3.V+ v234.57,15.62 AD0_0TO3.V+ v234.57,23.88 | GVCD_0TO3.V+ 242.17,16.89 v240.92,15.64 | SCL_PULLUP_0TO3.1 216.78,18.15 v216.78,17.9 | SDA_PULLUP_0TO3.1 230.2,23.85 v230.23,23.88 | CONTROLLER1.16 94.36,17.91 PWR_REG_100NF_0TO1.1 94.08,16.16 95.3,16.16 95.55,16.41 CONTROLLER1.19 CONTROLLER1.18
  Bottom 0.254: PWR_REG_100NF_0TO1.1 92.59,16.89 91.58,15.88 90.3,15.88 89.03,17.14 PWR_REG_10UF_0TO1.+ 86.58,17.14 86.53,17.1 v35.05,17.1 22.23,17.1 | GVCD_0TO1.V+ AD0_0TO1.V+ | 22.23,17.1 11.45,17.1 v10.43,18.11 | SCL_PULLUP_0TO1.1 22.23,17.1 | PWR_REG_10UF_0TO3.+ 193.8,17.4 PWR_REG_100NF_0TO3.1 198.46,17.4 | 198.46,17.4 199.48,18.41 201.22,18.41 v201.58,18.06 | v240.92,15.64 240.9,15.62 v234.57,15.62 | v234.57,23.88 v230.23,23.88 SCL_PULLUP_0TO3.1 | v216.78,17.9 216.54,18.13 215.29,18.13 212.7,15.54 200.32,15.54 198.46,17.4
  pour Top (isolate 0.406): 0.13,0.13 0.13,37.97 246.25,37.97 246.25,0.13